# EAGLE design MoBa-Sicherungsverteiler_V100_2023-03-24 (EAGLE 9.6.2)
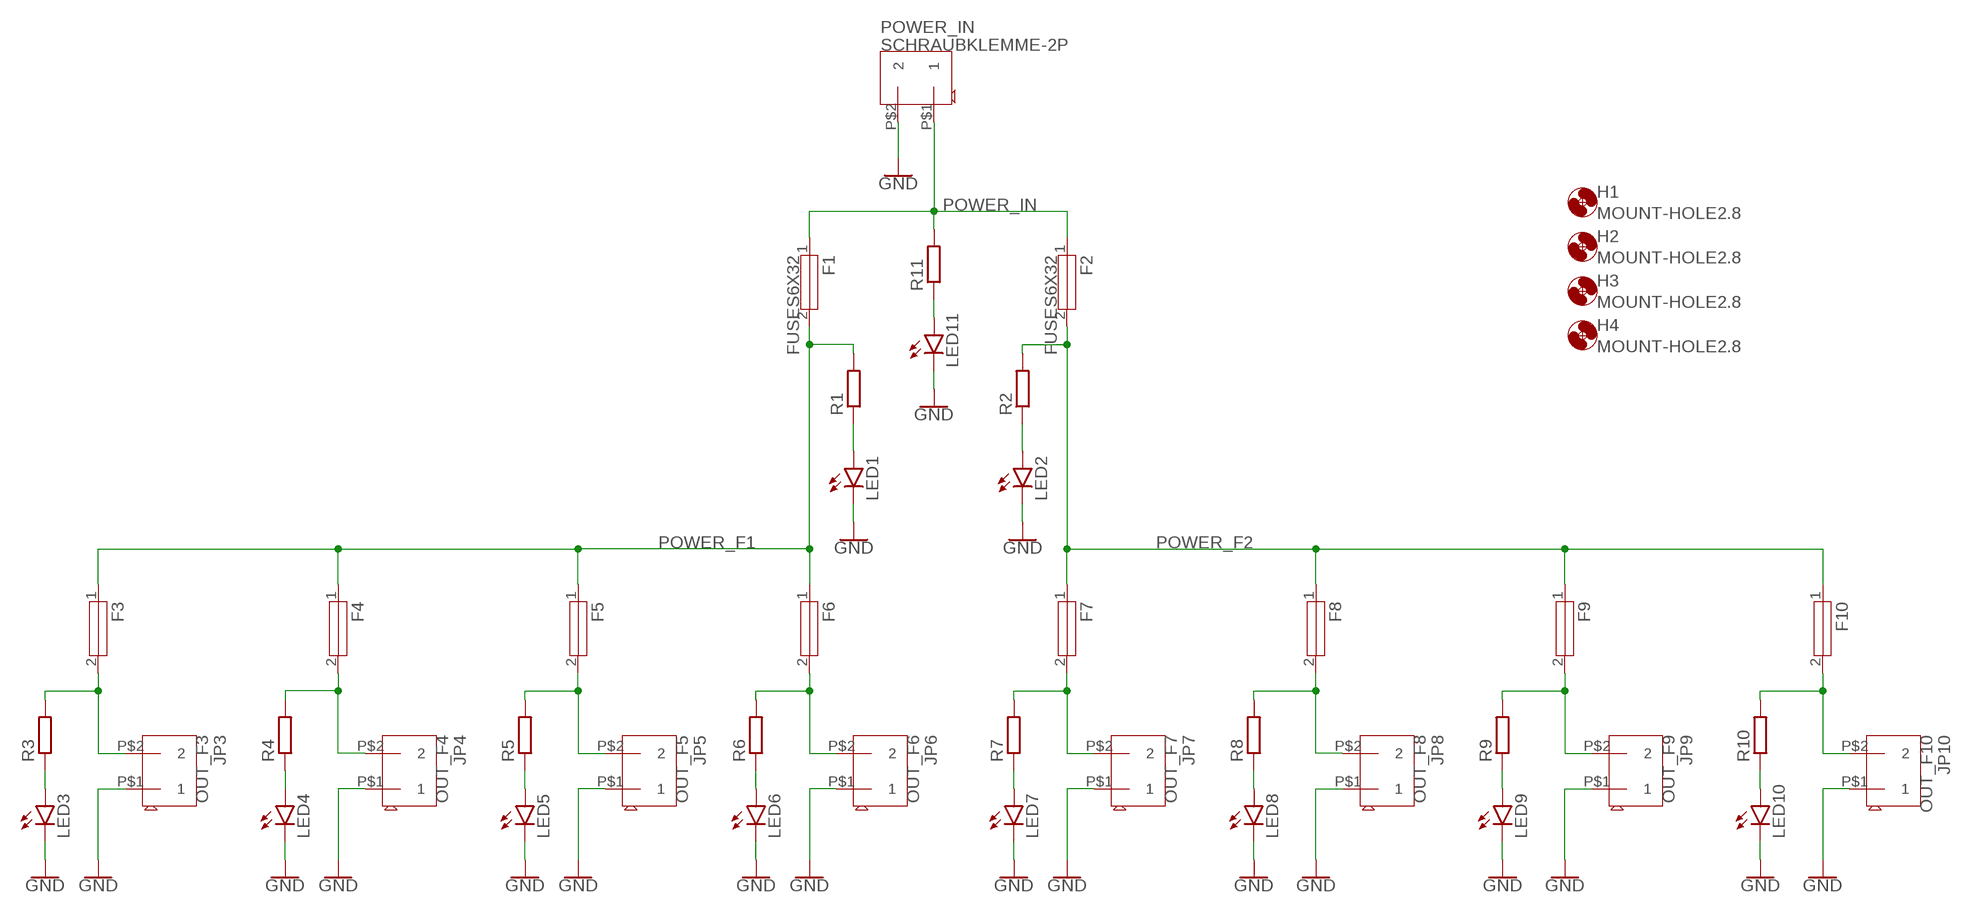
[diagram p0: schematic, sheet 1]

## Parts
F1  FUSES6X32  [FUSE_6X32]
F2  FUSES6X32  [FUSE_6X32]
F3  FUSES5X20  [FUSE_5X20]
F4  FUSES5X20  [FUSE_5X20]
F5  FUSES5X20  [FUSE_5X20]
F6  FUSES5X20  [FUSE_5X20]
F7  FUSES5X20  [FUSE_5X20]
F8  FUSES5X20  [FUSE_5X20]
F9  FUSES5X20  [FUSE_5X20]
F10  FUSES5X20  [FUSE_5X20]
H1  MOUNT-HOLE2.8  [2,8]
H2  MOUNT-HOLE2.8  [2,8]
H3  MOUNT-HOLE2.8  [2,8]
H4  MOUNT-HOLE2.8  [2,8]
JP3  OUT_F3  SCHRAUBKLEMME-2P  [TERM-2P_508]
JP4  OUT_F4  SCHRAUBKLEMME-2P  [TERM-2P_508]
JP5  OUT_F5  SCHRAUBKLEMME-2P  [TERM-2P_508]
JP6  OUT_F6  SCHRAUBKLEMME-2P  [TERM-2P_508]
JP7  OUT_F7  SCHRAUBKLEMME-2P  [TERM-2P_508]
JP8  OUT_F8  SCHRAUBKLEMME-2P  [TERM-2P_508]
JP9  OUT_F9  SCHRAUBKLEMME-2P  [TERM-2P_508]
JP10  OUT_F10  SCHRAUBKLEMME-2P  [TERM-2P_508]
LED1  LED3MM  [LED3MM]
LED2  LED3MM  [LED3MM]
LED3  LED3MM  [LED3MM]
LED4  LED3MM  [LED3MM]
LED5  LED3MM  [LED3MM]
LED6  LED3MM  [LED3MM]
LED7  LED3MM  [LED3MM]
LED8  LED3MM  [LED3MM]
LED9  LED3MM  [LED3MM]
LED10  LED3MM  [LED3MM]
LED11  LED3MM  [LED3MM]
POWER_IN  SCHRAUBKLEMME-2P  [TERM-2P_508]
R1  R-EU_0207/10  [0207/10]
R2  R-EU_0207/10  [0207/10]
R3  R-EU_0207/10  [0207/10]
R4  R-EU_0207/10  [0207/10]
R5  R-EU_0207/10  [0207/10]
R6  R-EU_0207/10  [0207/10]
R7  R-EU_0207/10  [0207/10]
R8  R-EU_0207/10  [0207/10]
R9  R-EU_0207/10  [0207/10]
R10  R-EU_0207/10  [0207/10]
R11  R-EU_0207/10  [0207/10]

## Nets
GND: JP3.P$1 JP4.P$1 JP5.P$1 JP6.P$1 JP7.P$1 JP8.P$1 JP9.P$1 JP10.P$1 LED1.K(C) LED2.K(C) LED3.K(C) LED4.K(C) LED5.K(C) LED6.K(C) LED7.K(C) LED8.K(C) LED9.K(C) LED10.K(C) LED11.K(C) POWER_IN.P$2
N$18: LED8.A R8.1
N$22: LED11.A R11.1
POWER_F1: F1.2 F3.1 F4.1 F5.1 F6.1 R1.2
POWER_F2: F2.2 F7.1 F8.1 F9.1 F10.1 R2.2
POWER_F3: F3.2 JP3.P$2 R3.2
POWER_F4: F4.2 JP4.P$2 R4.2
POWER_F5: F5.2 JP5.P$2 R5.2
POWER_F6: F6.2 JP6.P$2 R6.2
POWER_F7: F7.2 JP7.P$2 R7.2
POWER_F8: F8.2 JP8.P$2 R8.2
POWER_F9: F9.2 JP9.P$2 R9.2
POWER_F10: F10.2 JP10.P$2 R10.2
POWER_IN: F1.1 F2.1 POWER_IN.P$1 R11.2
RL1: LED1.A R1.1
RL2: LED2.A R2.1
RL3: LED3.A R3.1
RL4: LED4.A R4.1
RL5: LED5.A R5.1
RL6: LED6.A R6.1
RL7: LED7.A R7.1
RL9: LED9.A R9.1
RL10: LED10.A R10.1

## Library data of the parts
F1-F10 = MLL-Dominik-Hardi:FUSES
H1-H4 = holes:MOUNT-HOLE: MOUNTING HOLE with drill center marker
JP3-JP10 POWER_IN = MLL-Dominik-Hardi:SCHRAUBKLEMME-2P
LED1-LED11 = led:LED: LED OSRAM: - CHIPLED LG R971, LG N971, LY N971, LG Q971, LY Q971, LO R971, LY R971 LH N974, LH R974 LS Q976, LO Q976, LY Q976 LO Q996 - Hyper CHIPLED LW Q18S LB Q993, LB Q99A, LB R99A - SideLED LS A670, LO A670, LY A670, LG A670, LP A670 LB A673, LV A673, LT A673, LW A673 LH A674 LY A675 LS A676, LA A676, LO A676, LY A676, LW A676 LS A679, LY A679, LG A679 - Hyper Micro SIDELED® LS Y876, LA Y876, LO Y876, LY Y876 LT Y87S - SmartLED LW L88C, LW L88S LB L89C, LB L89S, LG L890 LS L89K, LO L89K, LY L89K LS L896, LA L896, LO L896, LY L896 - TOPLED LS T670, LO T670, LY T670, LG T670, LP T670 LSG T670, LSP T670, LSY T670, LOP T670, LYG T670 LG T671, LOG T671, LSG T671 LB T673, LV T673, LT T673, LW T673 LH T674 LS T676, LA T676, LO T676, LY T676, LB T676, LH T676, LSB T676, LW T676 LB T67C, LV T67C, LT T67C, LS T67K, LO T67K, LY T67K, LW E67C LS E67B, LA E67B, LO E67B, LY E67B, LB E67C, LV E67C, LT E67C LW T67C LS T679, LY T679, LG T679 LS T770, LO T770, LY T770, LG T770, LP T770 LB T773, LV T773, LT T773, LW T773 LH T774 LS E675, LA E675, LY E675, LS T675 LS T776, LA T776, LO T776, LY T776, LB T776 LHGB T686 LT T68C, LB T68C - Hyper Mini TOPLED® LB M676 - Mini TOPLED Santana® LG M470 LS M47K, LO M47K, LY M47K Source: http://www.osram.convergy.de LUXEON: - LUMILED® LXK2-PW12-R00, LXK2-PW12-S00, LXK2-PW14-U00, LXK2-PW14-V00 LXK2-PM12-R00, LXK2-PM12-S00, LXK2-PM14-U00 LXK2-PE12-Q00, LXK2-PE12-R00, LXK2-PE12-S00, LXK2-PE14-T00, LXK2-PE14-U00 LXK2-PB12-K00, LXK2-PB12-L00, LXK2-PB12-M00, LXK2-PB14-N00, LXK2-PB14-P00, LXK2-PB14-Q00 LXK2-PR12-L00, LXK2-PR12-M00, LXK2-PR14-Q00, LXK2-PR14-R00 LXK2-PD12-Q00, LXK2-PD12-R00, LXK2-PD12-S00 LXK2-PH12-R00, LXK2-PH12-S00 LXK2-PL12-P00, LXK2-PL12-Q00, LXK2-PL12-R00 Source: www.luxeon.com KINGBRIGHT: KA-3528ASYC Source: www.kingbright.com
R1-R11 = rcl:R-EU_: RESISTOR, European symbol; SPICEPREFIX: R

## Board
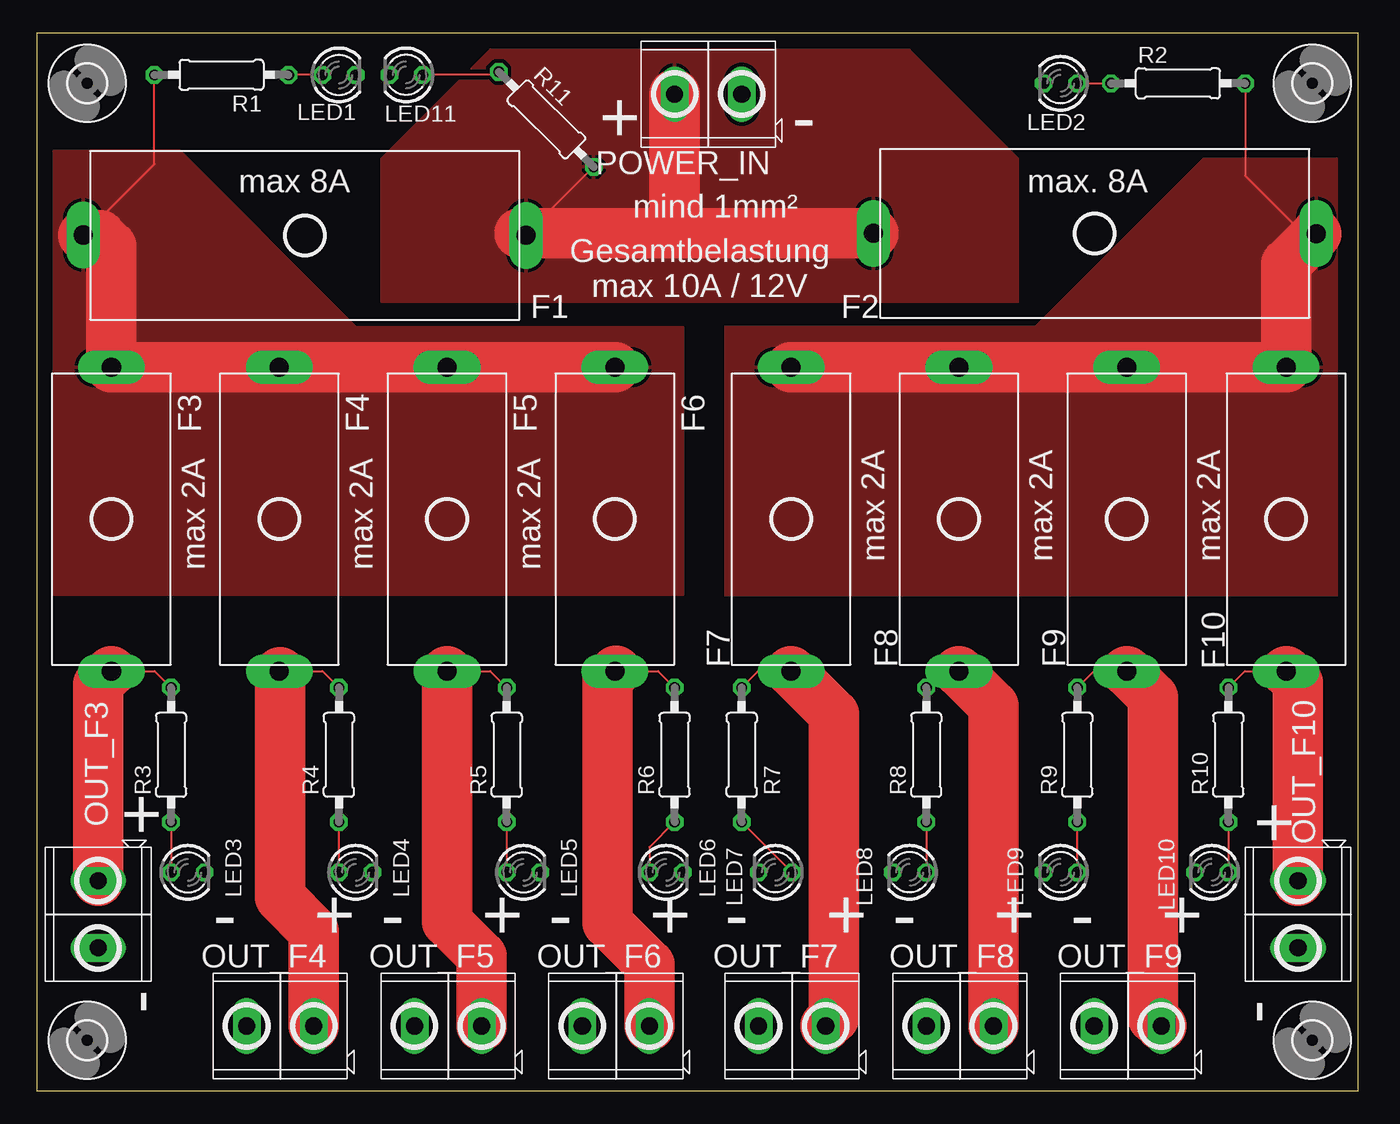
[diagram p1: board, top side]
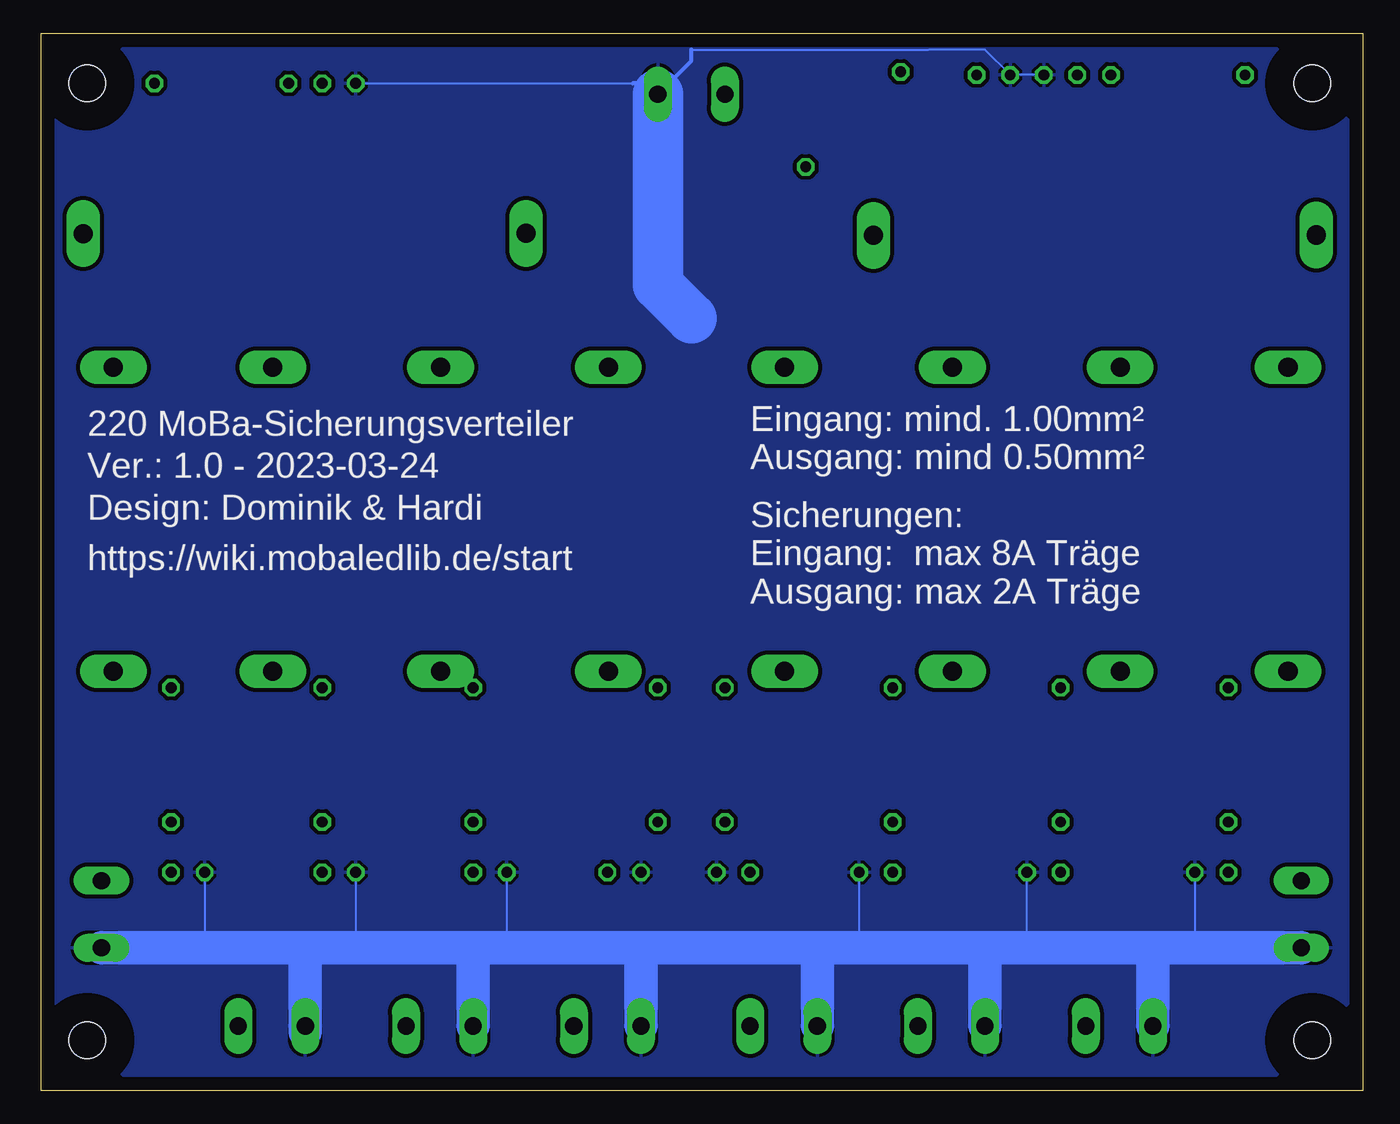
[diagram p2: board, bottom side, seen from below]

Size 100 x 80 mm. Coordinates in mm from the lower left corner, seen from the top.
Outline: 0,0 100,0 100,80 0,80 0,0
Copper layers (1*16): Top 0.035mm / dielectric 1.5mm / Bottom 0.035mm
Design rules "verteiler": minimum track width 6mil, minimum drill 0.35mm, track to track 12mil, track to pad 12mil, pad to pad 12mil, via to via 12mil, smd to smd 10mil, copper to edge 40mil, drill to drill 6mil, minimum pad ring 10mil, minimum via ring 8mil, stop-mask expansion 4mil, vias tented up to drill 0mil, thermal gap 10mil

### Footprints (pad centres in the part's own frame; a part is rotated, then mirrored left to right if it is on the bottom)
FUSE_6X32 = drill 1.45 pad 2.54 long: 1 -16.7,0.075; 2 16.8,0.05
FUSE_5X20 = drill 1.45 pad 2.54 long: 1 -11.549,-0.072; 2 11.451,-0.072
2,8 = hole 2.8: 0,0
TERM-2P_508 = drill 1.3 pad 2.1 long: P$1 2.54,0.19; P$2 -2.54,0.19
LED3MM = drill 0.813 octagon: A -1.27,0; K 1.27,0
0207/10 = drill 0.813 octagon: 1 -5.08,0; 2 5.08,0

### Placement (x,y rotation side)
F1  20.32,64.77 180 top
F2  80.01,64.77 0 top
F3  5.71,43.18 270 top
F4  18.41,43.18 270 top
F5  31.11,43.18 270 top
F6  43.81,43.18 270 top
F7  57.15,43.18 270 top
F8  69.85,43.18 270 top
F9  82.55,43.18 270 top
F10  94.61,43.18 270 top
H1  3.81,3.81 0 top
H2  96.52,76.2 0 top
H3  3.81,76.2 0 top
H4  96.52,3.81 0 top
JP3  4.45,13.34 270 top
JP4  18.41,5.08 180 top
JP5  31.11,5.08 180 top
JP6  43.81,5.08 180 top
JP7  57.15,5.08 180 top
JP8  69.85,5.08 180 top
JP9  82.55,5.08 180 top
JP10  95.25,13.34 270 top
LED1  22.86,76.83 0 top
LED2  77.47,76.2 180 top
LED3  11.43,16.51 0 top
LED4  24.13,16.51 0 top
LED5  36.83,16.51 0 top
LED6  47.62,16.51 0 top
LED7  55.88,16.51 180 top
LED8  66.04,16.51 180 top
LED9  77.47,16.51 180 top
LED10  88.9,16.51 180 top
LED11  27.94,76.83 180 top
POWER_IN  50.8,75.56 180 top
R1  13.97,76.83 180 top
R2  86.36,76.2 0 top
R3  10.16,25.4 90 top
R4  22.86,25.4 90 top
R5  35.56,25.4 90 top
R6  48.26,25.4 90 top
R7  53.34,25.4 90 top
R8  67.31,25.4 90 top
R9  78.74,25.4 90 top
R10  90.17,25.4 90 top
R11  38.55,73.47 315 top

### Tracks (layer width: path | path; a pad name or v marks a point on that pad's centre or on a via)
GND
  Bottom 0.152: LED3.K 12.7,11.43 25.4,11.43 25.4,10.79 LED4.K | LED5.K 38.1,10.79 | LED8.K 64.77,11.43 64.14,10.79 | LED9.K 76.2,10.79 | LED10.K 87.63,11.43 88.27,10.79 | LED2.K 55.24,76.2 54.16,76.2 | LED1.K LED11.K 28.58,78.74 32.85,78.74 50.8,78.74
  Bottom 0.305: 50.8,78.74 50.8,77.92 POWER_IN.P$2 54.16,76.2 55.24,76.2
  Bottom 2.54: 54.61,10.79 JP7.P$1 | 80.01,10.79 77.47,10.79 76.2,10.79 67.31,10.79 | 80.01,10.79 88.27,10.79 JP10.P$1 | 67.31,10.79 66.04,10.79 64.14,10.79 54.61,10.79 | 54.61,10.79 52.07,10.79 41.27,10.79 | JP8.P$1 67.31,10.79 | 80.01,10.79 JP9.P$1 80.01,4.45 | JP3.P$1 15.24,10.79 15.88,10.79 | 15.88,10.79 25.4,10.79 28.57,10.79 | 28.57,10.79 38.1,10.79 40.64,10.79 41.27,10.79 | JP6.P$1 41.27,10.79 | JP5.P$1 28.57,10.79 | JP4.P$1 15.88,10.79
  Bottom 3.81: POWER_IN.P$2 53.34,60.96 50.8,58.42
  pour Bottom: 3.81,76.2 0,72.39 0,7.62 7.62,0 92.71,0 99.69,6.99 99.69,73.03 92.71,80.01 7.62,80.01
N$18
  Top 0.152: R8.1 LED8.A
N$22
  Top 0.152: R11.1 34.73,76.83 LED11.A
POWER_F1
  Top 0.152: F1.2 8.89,70.09 R1.2 | F4.1 18.88,54.73 18.97,54.63 18.97,54.73 | 31.55,54.73 31.55,54.63 31.55,54.37 F5.1
  Top 2.54: F5.1 31.55,54.73 | F4.1 18.97,54.73
  Top 3.81: F1.2 4.79,64.72 5.64,63.87 F3.1 18.97,54.73 | F6.1 F5.1 | 31.55,54.73 F4.1
  pour Top: 10.79,71.12 24.13,57.78 48.9,57.78 48.9,37.47 1.27,37.47 1.27,71.12
POWER_F2
  Top 0.152: R2.2 91.44,69.22 95.83,64.82 F2.2
  Top 2.54: F7.1 F8.1 F9.1
  Top 3.81: F2.2 94.54,62.55 F10.1 F7.1
  pour Top: 98.42,70.48 88.27,70.48 75.56,57.78 52.07,57.78 52.07,37.47 98.42,37.47
POWER_F3
  Top 0.152: F3.2 8.91,31.73 R3.2
  Top 3.81: JP3.P$2 4.63,30.72 F3.2
POWER_F4
  Top 0.152: F4.2 21.61,31.73 R4.2
  Top 2.54: 18.41,31.66 F4.2
  Top 3.81: JP4.P$2 20.95,12.06 18.41,14.61 18.41,31.66
POWER_F5
  Top 0.152: F5.2 34.31,31.73 R5.2
  Top 3.81: F5.2 31.04,12.77 33.66,10.16 JP5.P$2
POWER_F6
  Top 0.152: R6.2 47.01,31.73 F6.2 43.81,31.75
  Top 3.81: JP6.P$2 46.35,9.53 43.18,12.7 43.18,31.11 43.81,31.75 | 43.81,31.75
POWER_F7
  Top 0.152: F7.2 54.59,31.73 R7.2
  Top 3.81: JP7.P$2 60.33,5.53 60.33,28.48 F7.2
POWER_F8
  Top 0.152: R8.2 68.49,31.66 69.85,31.66
  Top 3.81: JP8.P$2 72.39,29.12 69.85,31.66 F8.2
POWER_F9
  Top 0.152: R9.2 79.92,31.66 82.55,31.66
  Top 3.81: JP9.P$2 84.45,5.53 84.45,29.75 82.55,31.66 F9.2
POWER_F10
  Top 0.152: R10.2 91.42,31.73 F10.2
  Top 3.81: F10.2 95.44,30.83 JP10.P$2
POWER_IN
  Top 0.152: F1.1 37.02,64.76 R11.2
  Top 2.54: 37.17,64.84 F1.1 46.91,64.69 48.26,66.04 49.45,64.84 F2.1 56.25,64.84 | 40.27,64.84 37.17,64.84 | 37.17,64.84 36.53,64.84 | POWER_IN.P$1 48.26,72.83
  Top 3.81: POWER_IN.P$1 48.26,66.04 | F2.1 36.53,64.84
  pour Top: 26.04,70.48 26.04,59.69 74.3,59.69 74.3,70.48 66.04,78.74 34.29,78.74
RL1
  Top 0.152: LED1.A R1.1
RL2
  Top 0.152: LED2.A R2.1
RL3
  Top 0.152: R3.1 LED3.A
RL4
  Top 0.152: LED4.A R4.1
RL5
  Top 0.152: R5.1 LED5.A
RL6
  Top 0.152: R6.1 46.35,18.41 LED6.A
RL7
  Top 0.152: R7.1 LED7.A
RL9
  Top 0.152: LED9.A R9.1
RL10
  Top 0.152: R10.1 LED10.A

### Text on the board
tNames: + | - | max 8A | max. 8A | mind 1mm² | Gesamtbelastung / max 10A / 12V | max 2A | max 2A | max 2A | max 2A | max 2A | max 2A | + | + | - | - | + | - | + | - | + | - | + | - | + | + | - | -
bNames: 220 MoBa-Sicherungsverteiler | Eingang: mind. 1.00mm² / Ausgang: mind 0.50mm² | Ver.: 1.0 - 2023-03-24 | Design: Dominik & Hardi | https://wiki.mobaledlib.de/start | Sicherungen: / Eingang: max 8A Träge / Ausgang: max 2A Träge